# Altium schematic sheet TopSheet.SchDoc
size A4; CompanyName: Technische Hochschule Nürnberg Georg Simon Ohm; Organization: UltraZohm; Address1: Kesslerplatz 12; Address2: 90489 Nürnberg; Address3: GERMANY; Website: www.ultrazohm.com
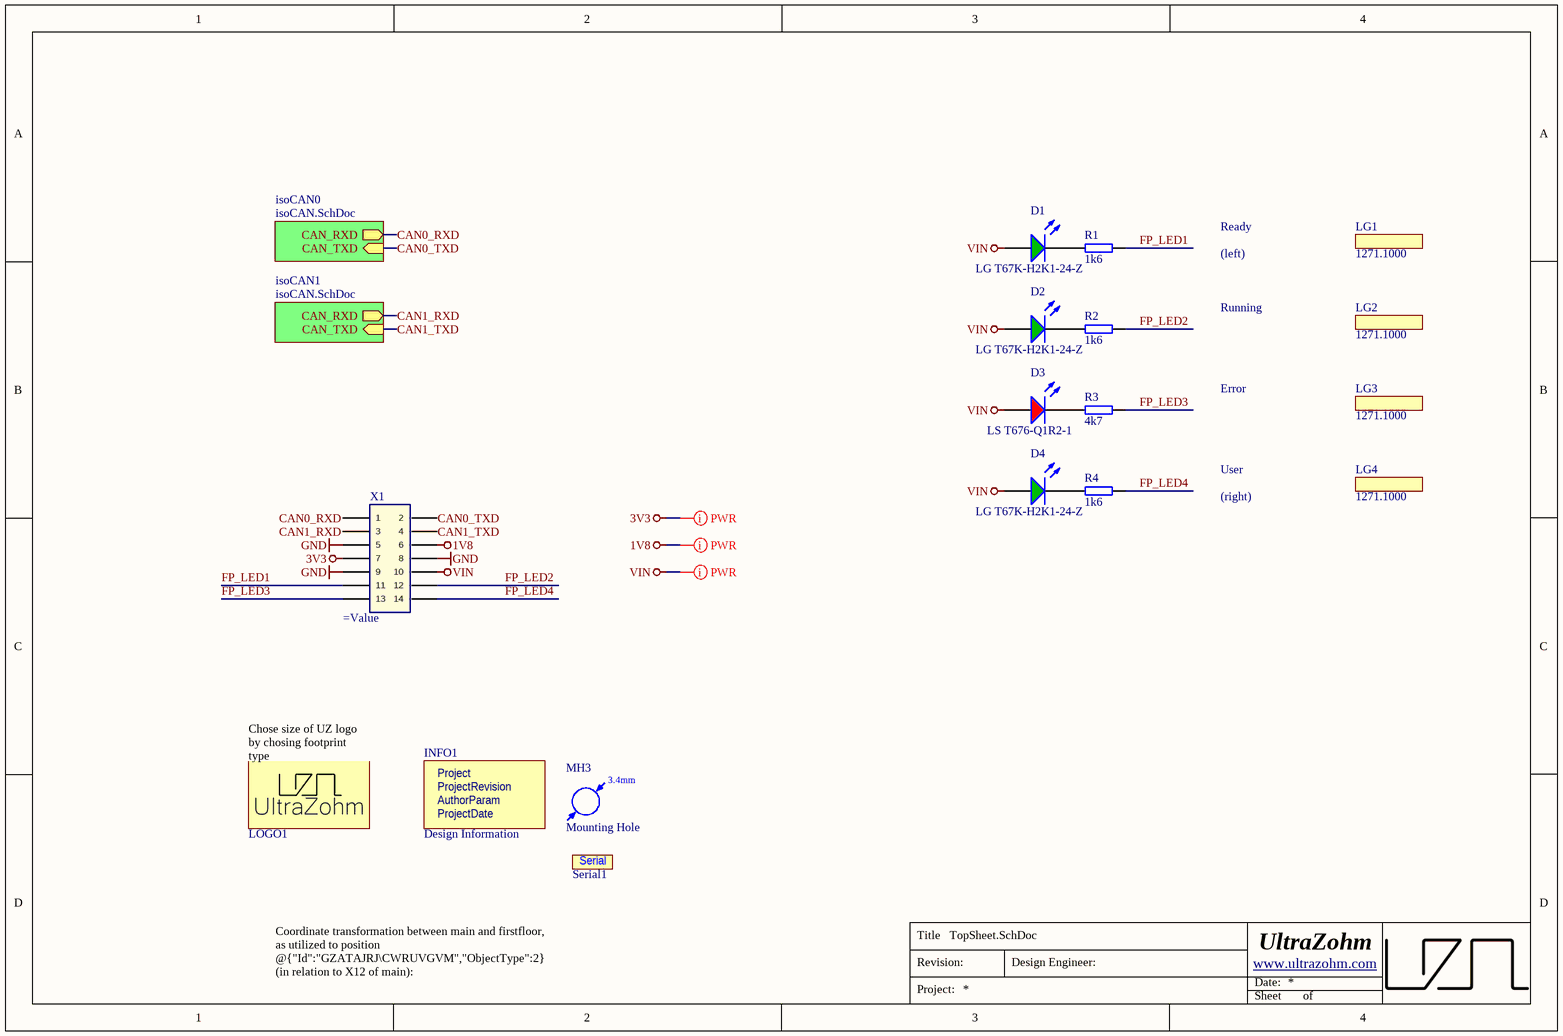
[diagram p0: TopSheet.SchDoc]

## Parts
D1  LG T67K-H2K1-24-Z  [FP-LS_T676-Q1R2-1-Z-MFG]
D2  LG T67K-H2K1-24-Z  [FP-LS_T676-Q1R2-1-Z-MFG]
D3  LS T676-Q1R2-1  [FP-LS_T676-Q1R2-1-Z-MFG]
D4  LG T67K-H2K1-24-Z  [FP-LS_T676-Q1R2-1-Z-MFG]
INFO1  Design Information  [Design_info]  (no BOM)
LG1  1271.1000  [1271.1000]
LG2  1271.1000  [1271.1000]
LG3  1271.1000  [1271.1000]
LG4  1271.1000  [1271.1000]
LOGO1  UZ Logo  [UZ_Logo_small]  (value not drawn)  (no BOM)
MH3  Mounting Hole  [MH_3.4]  (no BOM)
R1  1k6  [R_1206_TE]
R2  1k6  [R_1206_TE]
R3  4k7  [R_1206_TE]
R4  1k6  [R_1206_TE]
Serial1  Serial #  [SERIAL]  (value not drawn)  (no BOM)
X1  (no value)  [MTSW-107-11-T-D-740]

## Sub-sheets
isoCAN0 = isoCAN.SchDoc: CAN_RXD (out), CAN_TXD (in)
isoCAN1 = isoCAN.SchDoc: CAN_RXD (out), CAN_TXD (in)

## Nets
1V8: X1.6
3V3: X1.7
GND: X1.5 X1.8 X1.9
VIN: D1.2(A) D2.2(A) D3.2(A) D4.2(A) X1.10
CAN0_RXD: X1.1 ; sheet isoCAN0/CAN_RXD
CAN0_TXD: X1.2 ; sheet isoCAN0/CAN_TXD
CAN1_RXD: X1.3 ; sheet isoCAN1/CAN_RXD
CAN1_TXD: X1.4 ; sheet isoCAN1/CAN_TXD
FP_LED1: R1.2 X1.11
FP_LED2: R2.2 X1.12
FP_LED3: R3.2 X1.13
FP_LED4: R4.2 X1.14
NetD1_1: D1.1(K) R1.1
NetD2_1: D2.1(K) R2.1
NetD3_1: D3.1(K) R3.1
NetD4_1: D4.1(K) R4.1

## Layout directives
mark named PWR: 1V8, 3V3, VIN

## Notes on the sheet
- Ready
- Running
- (left)
- Error
- User
- (right)
- (near LOGO1) Chose size of UZ logo by chosing footprint type
- Coordinate transformation between main and firstfloor,
  as utilized to position @{"Id":"GZATAJRJ\CWRUVGVM","ObjectType":2} (in relation to X12 of main):
  - x_first = y_main + 77.5mm
  - y_first = 156mm - x_main
- Title
- Revision:
- Design Engineer:
- Date:
- Project:
- Sheet
- of
- (in symbol 6) Serial
- (in symbol Design Information) Project; ProjectRevision; AuthorParam; ProjectDate
- (in symbol Mounting Hole) 3.4mm

## Library data of the parts
D1 D2 D4 = LG T67K-H2K1-24-Z: Standard LEDs - SMD Green, 570nm 9mcd, 2mA; Manufacturer: OSRAM Opto Semicon; Created from: FRosner; Forward Current I_f: 20 mA; Forward Voltage U_f: 2.2V; Light Intensity: 6.28 mcd; Nominal Power: 44mW; Manufacturer Part Number: LG T67K-H2K1-24-Z; PartID: 17; Created On: 17/07/2024 13:28:00; ComponentLink1Description: Datasheet; ComponentLink1URL: https://dammedia.osram.info/media/resource/hires/osram-dam-5522864/LG%20T67K_EN.pdf; Component Type: LED Diode; Device Package: PLCC-2; Last Updated: 17/07/2024 14:01:05; Mounting Type: SMD; Operating Temperature: -40 - 100 °C; Supplier 1: LCSC; Supplier Part Number 1: C5248446; Type: Standard; Live Cycle Status: 1; Stock number: not stored; Color: green; Wavelength: 570 nm; LCSC Part Number: C5248446
D3 = LS T676-Q1R2-1: Standard LEDs - SMD Super Red, 645nm 180mcd, 20mA; Manufacturer: OSRAM Opto Semicon; Created from: FRosner; Forward Voltage U_f: 2.3V; Wavelength: 633 nm; Light Intensity: 71 ... 180 mcd; Nominal Power: 46mW; Manufacturer Part Number: LS T676-Q1R2-1; PartID: 16; Created On: 17/07/2024 13:16:06; ComponentLink1Description: Datasheet; ComponentLink1URL: https://wmsc.lcsc.com/wmsc/upload/file/pdf/v2/lcsc/2312251447_OSRAM-Opto-Semicon-LS-T676-Q1R2-1_C19360690.pdf; Component Type: LED Diode; Device Package: PLCC-2; Last Updated: 17/07/2024 13:21:16; Mounting Type: SMD; Operating Temperature: -40 - 100 °C; Supplier 1: LCSC; Supplier Part Number 1: C19360690; Type: Standard; Live Cycle Status: 1; Stock number: not stored; Color: red; Forward Current I_f: 20 mA; LCSC Part Number: C19360690
INFO1 = Design Information: Manufacturer: UltraZohm; Created from: MGremer; Manufacturer Part Number: Design Information; PartID: 12; Created On: 03.11.2021 09:04:23; ComponentLink1Description: https://docs.ultrazohm.com/; ComponentLink1URL: homepage; Component Type: Design Information; Last Updated: 03.11.2021 09:28:34; Supplier 1: -; Supplier Part Number 1: -; Type: Design Information; Value: Design Information; Live Cycle Status: 1
LG1-LG4 = 1271.1000: Light guide, horizontal, 18.29 mm, 1 rod, round, PCB mounting, transparent; Manufacturer: MENTOR; Created from: FRosner; Value: 1271.1000; Manufacturer Part Number: 1271.1000; PartID: 39; Created On: 15.07.2024 08:35:38; ComponentLink1Description: Datasheet; ComponentLink1URL: https://www.farnell.com/datasheets/1693501.pdf; Component Type: Light Guide; Device Package: SMD; Last Updated: 15.07.2024 08:35:38; Mounting Type: SMD; Operating Temperature: -40°C - +85°C; Supplier 1: Farnell; Supplier Part Number 1: 2300553; Supplier 2: LCSC; Supplier Part Number 2: C22441102; Type: Lightguide; Live Cycle Status: 1; LCSC Part Number: C22441102; Stock number: not stored
LOGO1 = 1: Official Project Logo of the UltraZohm; Manufacturer: PCB Manufacturer; Manufacturer Part Number: UltraZohm Logo; Created from: T. Wendt; PartID: 1; Created On: 19.02.2021 16:55:56; ComponentLink1Description: Homepage; ComponentLink1URL: https://ultrazohm.com; Component Type: Logo; Last Updated: 02.03.2021 14:31:24; Type: Standard (No BOM); Live Cycle Status: 1
MH3 = Mounting Hole: Created from: MHlatky; Manufacturer Part Number: Mounting Hole; PartID: 16; Created On: 26/01/2021 09:19:51; ComponentLink1Description: Datasheet; Component Type: Mounting Hole; Device Package: -; Last Updated: 21/03/2022 23:05:12; Manufacturer: Mounting Hole; Supplier 1: Mounting Hole; Supplier Part Number 1: Mounting Hole; Type: Mounting Hole; Value: Mounting Hole; Live Cycle Status: 1; Stock number: not stored
R1 R2 R4 = UZgen_R_1206_1k6: Generic resistor; Manufacturer: UZgen; Tolerance: 1 %; Created from: UZgenTool; Manufacturer Part Number: UZgen_R_1206_1k6; PartID: 513; Created On: 02/07/2024 17:29:56; Device Package: 1206; Last Updated: 02/07/2024 17:29:56; Mounting Type: SMD; Value: 1k6
R3 = UZgen_R_1206_4k7: Generic resistor; Manufacturer: UZgen; Tolerance: 1 %; Created from: UZgenTool; Manufacturer Part Number: UZgen_R_1206_4k7; PartID: 524; Created On: 02/07/2024 17:29:56; Device Package: 1206; Last Updated: 02/07/2024 17:29:56; Mounting Type: SMD; Value: 4k7
Serial1 = 6: Field to put in a serial number; Manufacturer: PCB Manufacturer; Created from: T. Wendt; PartID: 6; Created On: 02.03.2021 14:31:24; Component Type: Serial Number; Last Updated: 02.03.2021 14:31:24; Manufacturer Part Number: Serial Number; Type: Standard (No BOM); Live Cycle Status: 1
X1 = MTSW-107-11-T-D-740: Headers & Wire Housings Classic PCB Header Strips, 0.100" pitch; Manufacturer: SAMTEC; Created from: FRosner; Manufacturer Part Number: MTSW-107-11-T-D-740; PartID: 50; Created On: 03/07/2024 10:17:57; ComponentLink1Description: Datasheet; ComponentLink1URL: https://wmsc.lcsc.com/wmsc/upload/file/pdf/v2/lcsc/2404031808_Samtec-MTSW-107-11-T-D-740_C3332627.pdf; Last Updated: 10/10/2024 14:28:05; Mounting Type: THT; Operating Temperature: -55 °C to +125 °C; Series: TSW; Supplier 1: LCSC; Supplier Part Number 1: C3332627; Value: MTSW-107-11-T-D-740; LCSC Part Number: C3332627